# Altium schematic sheet main.SchDoc
size A3
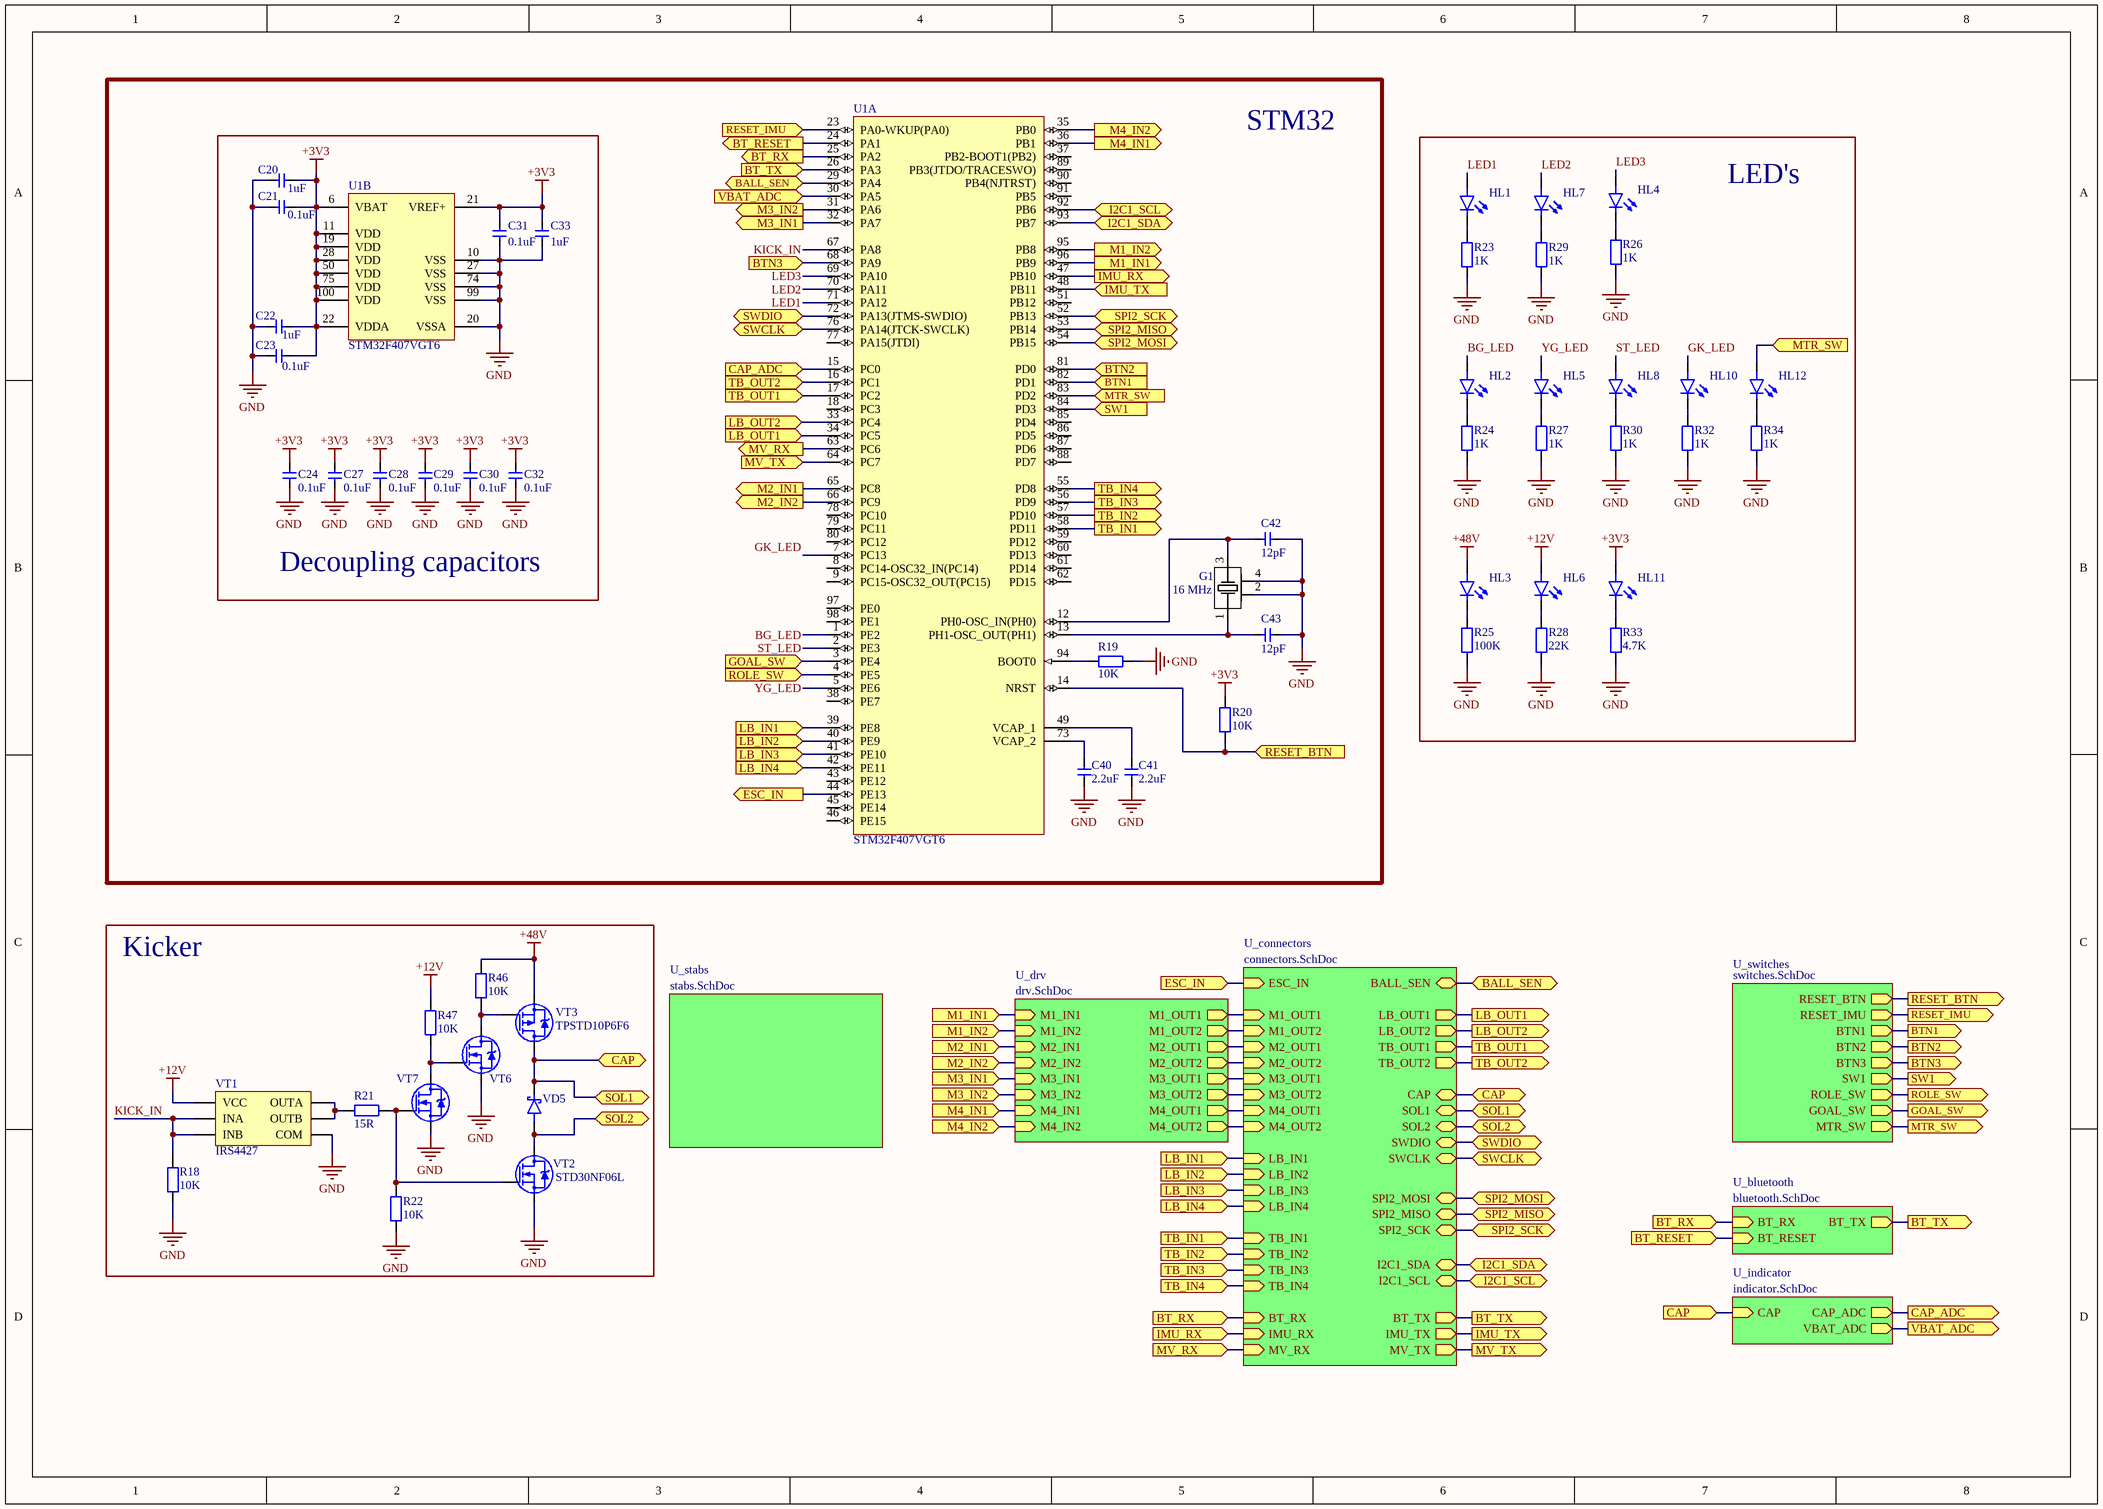
[diagram p0: main.SchDoc]

## Parts
C20  1uF  [CAP0805]
C21  0.1uF  [CAP0805]
C22  1uF  [CAP0805]
C23  0.1uF  [CAP0805]
C24  0.1uF  [CAP0805]
C27  0.1uF  [CAP0805]
C28  0.1uF  [CAP0805]
C29  0.1uF  [CAP0805]
C30  0.1uF  [CAP0805]
C31  0.1uF  [CAP0805]
C32  0.1uF  [CAP0805]
C33  1uF  [CAP0805]
C40  2.2uF  [CAP0805]
C41  2.2uF  [CAP0805]
C42  12pF  [CAP0805]
C43  12pF  [CAP0805]
G1  16 MHz  [TSX-3225]
HL1  White  [LED0603_WHITE]  (value not drawn)
HL2  White  [LED0603_WHITE]  (value not drawn)
HL3  Green  [LED0603_GREEN]  (value not drawn)
HL4  White  [LED0603_WHITE]  (value not drawn)
HL5  White  [LED0603_WHITE]  (value not drawn)
HL6  Green  [LED0603_GREEN]  (value not drawn)
HL7  White  [LED0603_WHITE]  (value not drawn)
HL8  White  [LED0603_WHITE]  (value not drawn)
HL10  White  [LED0603_WHITE]  (value not drawn)
HL11  Green  [LED0603_GREEN]  (value not drawn)
HL12  Red  [LED0603_RED]  (value not drawn)
R18  10K  [RES0805]
R19  10K  [RES0805]
R20  10K  [RES0805]
R21  15R  [RES1206]
R22  10K  [RES0805]
R23  1K  [RES0805]
R24  1K  [RES0805]
R25  100K  [RES0805]
R26  1K  [RES0805]
R27  1K  [RES0805]
R28  22K  [RES0805]
R29  1K  [RES0805]
R30  1K  [RES0805]
R32  1K  [RES0805]
R33  4.7K  [RES0805]
R34  1K  [RES0805]
R46  10K  [RES0805]
R47  10K  [RES0805]
U1  STM32F407VGT6  [LQFP100]  (parts A,B of 2)
VD5  (no value)  [DO-214AC (SMA)]
VT1  IRS4427  [SOIC-8]
VT2  STD30NF06L  [DPAK]
VT3  TPSTD10P6F6  [DPAK]
VT6  IRLML2502  [SOT-23-3]  (value not drawn)
VT7  IRLML2502  [SOT-23-3]  (value not drawn)

## Blocks framed on the sheet
STM32: C40-C43 G1 R19 R20 U1
Decoupling capacitors: C20-C24 C27-C33 U1
LED's: HL1-HL8 HL10-HL12 R23-R30 R32-R34
Kicker: R18 R21 R22 R46 R47 VD5 VT1-VT3 VT6 VT7

## Sub-sheets
U_bluetooth = bluetooth.SchDoc: BT_TX (out), BT_RX (in), BT_RESET (in)
U_connectors = connectors.SchDoc: ESC_IN (in), M1_OUT1 (in), M1_OUT2 (in), M2_OUT1 (in), M2_OUT2 (in), M3_OUT1 (in), M3_OUT2 (in), M4_OUT1 (in), M4_OUT2 (in), SOL2 (bidir), SOL1 (bidir), CAP (bidir), BALL_SEN (bidir), SWDIO (bidir), SWCLK (bidir), LB_OUT2 (out), LB_OUT1 (out), LB_IN1 (in), LB_IN2 (in), LB_IN3 (in), LB_IN4 (in), TB_IN1 (in), TB_IN2 (in), TB_IN3 (in), TB_IN4 (in), TB_OUT1 (out), TB_OUT2 (out), BT_TX (out), BT_RX (in), IMU_RX (in), IMU_TX (out), MV_RX (in), MV_TX (out), SPI2_MOSI (bidir), I2C1_SCL (bidir), I2C1_SDA (bidir), SPI2_SCK (bidir), SPI2_MISO (bidir)
U_drv = drv.SchDoc: M1_IN1 (in), M1_IN2 (in), M1_OUT1 (out), M1_OUT2 (out), M2_IN1 (in), M2_IN2 (in), M2_OUT1 (out), M2_OUT2 (out), M4_IN1 (in), M4_IN2 (in), M4_OUT1 (out), M4_OUT2 (out), M3_IN1 (in), M3_IN2 (in), M3_OUT1 (out), M3_OUT2 (out)
U_indicator = indicator.SchDoc: VBAT_ADC (out), CAP (in), CAP_ADC (out)
U_stabs = stabs.SchDoc: no entries
U_switches = switches.SchDoc: RESET_BTN (out), RESET_IMU (out), BTN1 (out), BTN2 (out), BTN3 (out), SW1 (out), ROLE_SW (out), GOAL_SW (out), MTR_SW (out)

## Ports
BALL_SEN (bidir), BT_RESET (in), BT_RESET (out), BT_RX (in), BT_RX (out), BT_TX (in), BT_TX (out), BTN1 (in), BTN1 (out), BTN2 (in), BTN2 (out), BTN3 (in), BTN3 (out), CAP (bidir), CAP (in), CAP_ADC (in), CAP_ADC (out), ESC_IN (in), ESC_IN (out), GOAL_SW (in), GOAL_SW (out), I2C1_SCL (bidir), I2C1_SDA (bidir), IMU_RX (in), IMU_RX (out), IMU_TX (in), IMU_TX (out), LB_IN1 (in), LB_IN2 (in), LB_IN3 (in), LB_IN4 (in), LB_OUT1 (in), LB_OUT1 (out), LB_OUT2 (in), LB_OUT2 (out), M1_IN1 (in), M1_IN1 (out), M1_IN2 (in), M1_IN2 (out), M2_IN1 (in), M2_IN1 (out), M2_IN2 (in), M2_IN2 (out), M3_IN1 (in), M3_IN1 (out), M3_IN2 (in), M3_IN2 (out), M4_IN1 (in), M4_IN1 (out), M4_IN2 (in), M4_IN2 (out), MTR_SW (in), MTR_SW (out), MV_RX (in), MV_RX (out), MV_TX (in), MV_TX (out), RESET_BTN (in), RESET_BTN (out), RESET_IMU (in), RESET_IMU (out), ROLE_SW (in), ROLE_SW (out), SOL1 (bidir), SOL2 (bidir), SPI2_MISO (bidir), SPI2_MOSI (bidir), SPI2_SCK (bidir), SW1 (in), SW1 (out), SWCLK (bidir), SWDIO (bidir), TB_IN1 (in), TB_IN1 (out), TB_IN2 (in), TB_IN2 (out), TB_IN3 (in), TB_IN3 (out), TB_IN4 (in), TB_IN4 (out), TB_OUT1 (in), TB_OUT1 (out), TB_OUT2 (in), TB_OUT2 (out), VBAT_ADC (in), VBAT_ADC (out)

## Nets
+3V3: C20.1 C21.1 C22.1 C23.1 C24.1 C27.1 C28.1 C29.1 C30.1 C31.2 C32.1 C33.2 HL11.2(A) R20.1 U1.6(VBAT) U1.11(VDD) U1.19(VDD) U1.21(VREF+) U1.22(VDDA) U1.28(VDD) U1.50(VDD) U1.75(VDD) U1.100(VDD)
+12V: HL6.2(A) R47.2 VT1.6(VCC)
+48V: HL3.2(A) R46.2 VT3.S
GND: C20.2 C21.2 C22.2 C23.2 C24.2 C27.2 C28.2 C29.2 C30.2 C31.1 C32.2 C33.1 C40.1 C41.1 C42.2 C43.2 G1.2 G1.4 R18.1 R19.1 R22.1 R23.1 R24.1 R25.1 R26.1 R27.1 R28.1 R29.1 R30.1 R32.1 R33.1 R34.1 U1.10(VSS) U1.20(VSSA) U1.27(VSS) U1.74(VSS) U1.99(VSS) VT1.3(COM) VT2.S VT6.S VT7.S
BALL_SEN: U1.29(PA4) ; port BALL_SEN, sheet U_connectors/BALL_SEN
BG_LED: HL2.2(A) U1.1(PE2)
BT_RESET: U1.24(PA1) ; port BT_RESET, sheet U_bluetooth/BT_RESET
BT_RX: U1.25(PA2) ; port BT_RX, sheet U_bluetooth/BT_RX, sheet U_connectors/BT_RX
BT_TX: U1.26(PA3) ; port BT_TX, sheet U_bluetooth/BT_TX, sheet U_connectors/BT_TX
BTN1: U1.82(PD1) ; port BTN1, sheet U_switches/BTN1
BTN2: U1.81(PD0) ; port BTN2, sheet U_switches/BTN2
BTN3: U1.68(PA9) ; port BTN3, sheet U_switches/BTN3
CAP: VD5.K VT3.D ; port SOL1, port CAP, sheet U_indicator/CAP, sheet U_connectors/SOL1, sheet U_connectors/CAP
CAP_ADC: U1.15(PC0) ; port CAP_ADC, sheet U_indicator/CAP_ADC
ESC_IN: U1.44(PE13) ; port ESC_IN, sheet U_connectors/ESC_IN
GK_LED: HL10.2(A) U1.7(PC13)
GOAL_SW: U1.3(PE4) ; port GOAL_SW, sheet U_switches/GOAL_SW
I2C1_SCL: U1.92(PB6) ; port I2C1_SCL, sheet U_connectors/I2C1_SCL
I2C1_SDA: U1.93(PB7) ; port I2C1_SDA, sheet U_connectors/I2C1_SDA
IMU_RX: U1.47(PB10) ; port IMU_RX, sheet U_connectors/IMU_RX
IMU_TX: U1.48(PB11) ; port IMU_TX, sheet U_connectors/IMU_TX
KICK_IN: R18.2 U1.67(PA8) VT1.2(INA) VT1.4(INB)
LB_IN1: U1.39(PE8) ; port LB_IN1, sheet U_connectors/LB_IN1
LB_IN2: U1.40(PE9) ; port LB_IN2, sheet U_connectors/LB_IN2
LB_IN3: U1.41(PE10) ; port LB_IN3, sheet U_connectors/LB_IN3
LB_IN4: U1.42(PE11) ; port LB_IN4, sheet U_connectors/LB_IN4
LB_OUT1: U1.34(PC5) ; port LB_OUT1, sheet U_connectors/LB_OUT1
LB_OUT2: U1.33(PC4) ; port LB_OUT2, sheet U_connectors/LB_OUT2
LED1: HL1.2(A) U1.71(PA12)
LED2: HL7.2(A) U1.70(PA11)
LED3: HL4.2(A) U1.69(PA10)
M1_IN1: U1.96(PB9) ; port M1_IN1, sheet U_drv/M1_IN1
M1_IN2: U1.95(PB8) ; port M1_IN2, sheet U_drv/M1_IN2
M2_IN1: U1.65(PC8) ; port M2_IN1, sheet U_drv/M2_IN1
M2_IN2: U1.66(PC9) ; port M2_IN2, sheet U_drv/M2_IN2
M3_IN1: U1.32(PA7) ; port M3_IN1, sheet U_drv/M3_IN1
M3_IN2: U1.31(PA6) ; port M3_IN2, sheet U_drv/M3_IN2
M4_IN1: U1.36(PB1) ; port M4_IN1, sheet U_drv/M4_IN1
M4_IN2: U1.35(PB0) ; port M4_IN2, sheet U_drv/M4_IN2
MTR_SW: HL12.2(A) U1.83(PD2) ; port MTR_SW, sheet U_switches/MTR_SW
MV_RX: U1.63(PC6) ; port MV_RX, sheet U_connectors/MV_RX
MV_TX: U1.64(PC7) ; port MV_TX, sheet U_connectors/MV_TX
RESET_BTN: R20.2 U1.14(NRST) ; port RESET_BTN, sheet U_switches/RESET_BTN
RESET_IMU: U1.23(PA0-WKUP(PA0)) ; port RESET_IMU, sheet U_switches/RESET_IMU
ROLE_SW: U1.4(PE5) ; port ROLE_SW, sheet U_switches/ROLE_SW
SOL2: VD5.A VT2.D ; port SOL2, sheet U_connectors/SOL2
SPI2_MISO: U1.53(PB14) ; port SPI2_MISO, sheet U_connectors/SPI2_MISO
SPI2_MOSI: U1.54(PB15) ; port SPI2_MOSI, sheet U_connectors/SPI2_MOSI
SPI2_SCK: U1.52(PB13) ; port SPI2_SCK, sheet U_connectors/SPI2_SCK
ST_LED: HL8.2(A) U1.2(PE3)
SW1: U1.84(PD3) ; port SW1, sheet U_switches/SW1
SWCLK: U1.76(PA14(JTCK-SWCLK)) ; port SWCLK, sheet U_connectors/SWCLK
SWDIO: U1.72(PA13(JTMS-SWDIO)) ; port SWDIO, sheet U_connectors/SWDIO
TB_IN1: U1.58(PD11) ; port TB_IN1, sheet U_connectors/TB_IN1
TB_IN2: U1.57(PD10) ; port TB_IN2, sheet U_connectors/TB_IN2
TB_IN3: U1.56(PD9) ; port TB_IN3, sheet U_connectors/TB_IN3
TB_IN4: U1.55(PD8) ; port TB_IN4, sheet U_connectors/TB_IN4
TB_OUT1: U1.17(PC2) ; port TB_OUT1, sheet U_connectors/TB_OUT1
TB_OUT2: U1.16(PC1) ; port TB_OUT2, sheet U_connectors/TB_OUT2
VBAT_ADC: U1.30(PA5) ; port VBAT_ADC, sheet U_indicator/VBAT_ADC
YG_LED: HL5.2(A) U1.5(PE6)
NetC40_2: C40.2 U1.73(VCAP_2)
NetC41_2: C41.2 U1.49(VCAP_1)
NetC42_1: C42.1 G1.3 U1.12(PH0-OSC_IN(PH0))
NetC43_1: C43.1 G1.1 U1.13(PH1-OSC_OUT(PH1))
NetHL1_1: HL1.1(K) R23.2
NetHL2_1: HL2.1(K) R24.2
NetHL3_1: HL3.1(K) R25.2
NetHL4_1: HL4.1(K) R26.2
NetHL5_1: HL5.1(K) R27.2
NetHL6_1: HL6.1(K) R28.2
NetHL7_1: HL7.1(K) R29.2
NetHL8_1: HL8.1(K) R30.2
NetHL10_1: HL10.1(K) R32.2
NetHL11_1: HL11.1(K) R33.2
NetHL12_1: HL12.1(K) R34.2
NetR19_2: R19.2 U1.94(BOOT0)
NetR21_1: R21.1 VT1.5(OUTB) VT1.7(OUTA)
NetR21_2: R21.2 R22.2 VT2.G VT7.G
NetR46_1: R46.1 VT3.G VT6.D
NetR47_1: R47.1 VT6.G VT7.D
(unnamed): sheet U_drv/M1_OUT1, sheet U_connectors/M1_OUT1
(unnamed): sheet U_drv/M1_OUT2, sheet U_connectors/M1_OUT2
(unnamed): sheet U_drv/M2_OUT1, sheet U_connectors/M2_OUT1
(unnamed): sheet U_drv/M2_OUT2, sheet U_connectors/M2_OUT2
(unnamed): sheet U_drv/M4_OUT1, sheet U_connectors/M4_OUT1
(unnamed): sheet U_drv/M4_OUT2, sheet U_connectors/M4_OUT2
(unnamed): sheet U_drv/M3_OUT1, sheet U_connectors/M3_OUT1
(unnamed): sheet U_drv/M3_OUT2, sheet U_connectors/M3_OUT2

Not connected (* = marked no-connect by the designer): U1 8(PC14-OSC32_IN(PC14)) 9(PC15-OSC32_OUT(PC15)) 18(PC3) 37(PB2-BOOT1(PB2)) 38(PE7) 43(PE12) 45(PE14) 46(PE15) 51(PB12) 59(PD12) 60(PD13) 61(PD14) 62(PD15) 77(PA15(JTDI)) 78(PC10) 79(PC11) 80(PC12) 85(PD4) 86(PD5) 87(PD6) 88(PD7) 89(PB3(JTDO/TRACESWO)) 90(PB4(NJTRST)) 91(PB5) 97(PE0) 98(PE1)

## Library data of the parts
C20-C24 C27-C33 C40-C43 = CAP Ceramic: Ceramic SMD Cap
G1 = TSX-3225 24.0000MF15X-AC6: quartz 16MHz; Part Number: TSX-3225 24.0000MF15X-AC6; HelpURL: https://www.digikey.com/en/products/detail/epson/TSX-3225-24-0000MF15X-AC6/5261221; Price$: 0.33; Digi-Key Part Number: SER4180CT-ND; Manufacturer Part Number: TSX-3225 24.0000MF15X-AC6
HL1 = LED: LED1
HL2 = LED: BG
HL3 = LED: 48V power
HL4 = LED: LED3
HL5 = LED: YG
HL6 = LED: 12V power
HL7 = LED: LED2
HL8 = LED: ST
HL10 = LED: GK
HL11 = LED: 3V3 power
HL12 = LED: M_ON
R18-R30 R32-R34 R46 R47 = RES: RES smd
U1 = STM32F407VGT6: Manufacturer: STMicroelectronics; Core: ARM Cortex-M4; D/A Converter: 2x12-bit; FLASH Size (Prog) (kB): 1024; I/Os (High Current): 82; Internal RAM Size (kB): 192; Operating Frequency(F) (Processor speed) (MHz): 168; Packing: Tray; Supply Voltage(Vcc) max (V): 3.6; Supply Voltage(Vcc) min (V): 1.8; DatasheetVersion: Rev. 4; PackageVersion: Rev. 1, 06/2013; PackageReference: LQFP100; PackageDescription: 100-Pin Low Profile Quad Flat Package, 14 x 14 mm Body, 0.5 mm Pitch; Supplier 1: Digi-Key; Supplier Part Number 1: 497-11605-ND; Supplier 2: Farnell; Supplier Part Number 2: 2064368; Supplier 3: Newark; Supplier Part Number 3: 73T2333; Supplier 4: Mouser; Supplier Part Number 4: 511-STM32F407VGT6; Mounting Technology: Surface Mount; PartNumber: STM32F407VGT6; ComponentLink1Description: Manufacturer URL; ComponentLink1URL: http://www.st.com/web/en/home.html; ComponentLink2Description: Datasheet; ComponentLink2URL: http://www.st.com/st-web-ui/static/active/en/resource/technical/document/datasheet/DM00037051.pdf; ComponentLink3Description: Package Specification; ComponentLink3URL: http://www.st.com/st-web-ui/static/active/en/resource/technical/document/data_brief/DM00071938.pdf
VD5 = Diode Schottky
VT1 = IRS4427: Mosfet driver
VT2 = STD30NF06L: N-MOSFET / Uds = 60 V / Ids = 30 A / Rds = 0.023 Ohm / P = 55 W; ComponentLink1Description: Chipdip; ComponentLink1URL: https://www.chipdip.ru/product/std30nf06l-umw
VT3 = TPSTD10P6F6: P-MOSFET / Uds = 60 V / Ids = 13 A / Rds = 0.100 Ohm / P = 60 W; ComponentLink1Description: Chipdip; ComponentLink1URL: https://www.chipdip.ru/product/tpstd10p6f6
VT6 = IRLML2502: N-MOSFET / Uds = 20 V / Ids = 4.2 A / Rds = 0.035 Ohm / P = 1,25 W; ComponentLink1Description: Chipdip; ComponentLink1URL: https://www.chipdip.ru/product/irlml2502-umw
VT7 = IRLML2502: N-MOSFET / Uds = 20 V / Ids = 4.2 A / Rds = 0.035 Ohm / P = 8 W; ComponentLink1Description: Chipdip; ComponentLink1URL: https://www.chipdip.ru/product/irlml2502-umw